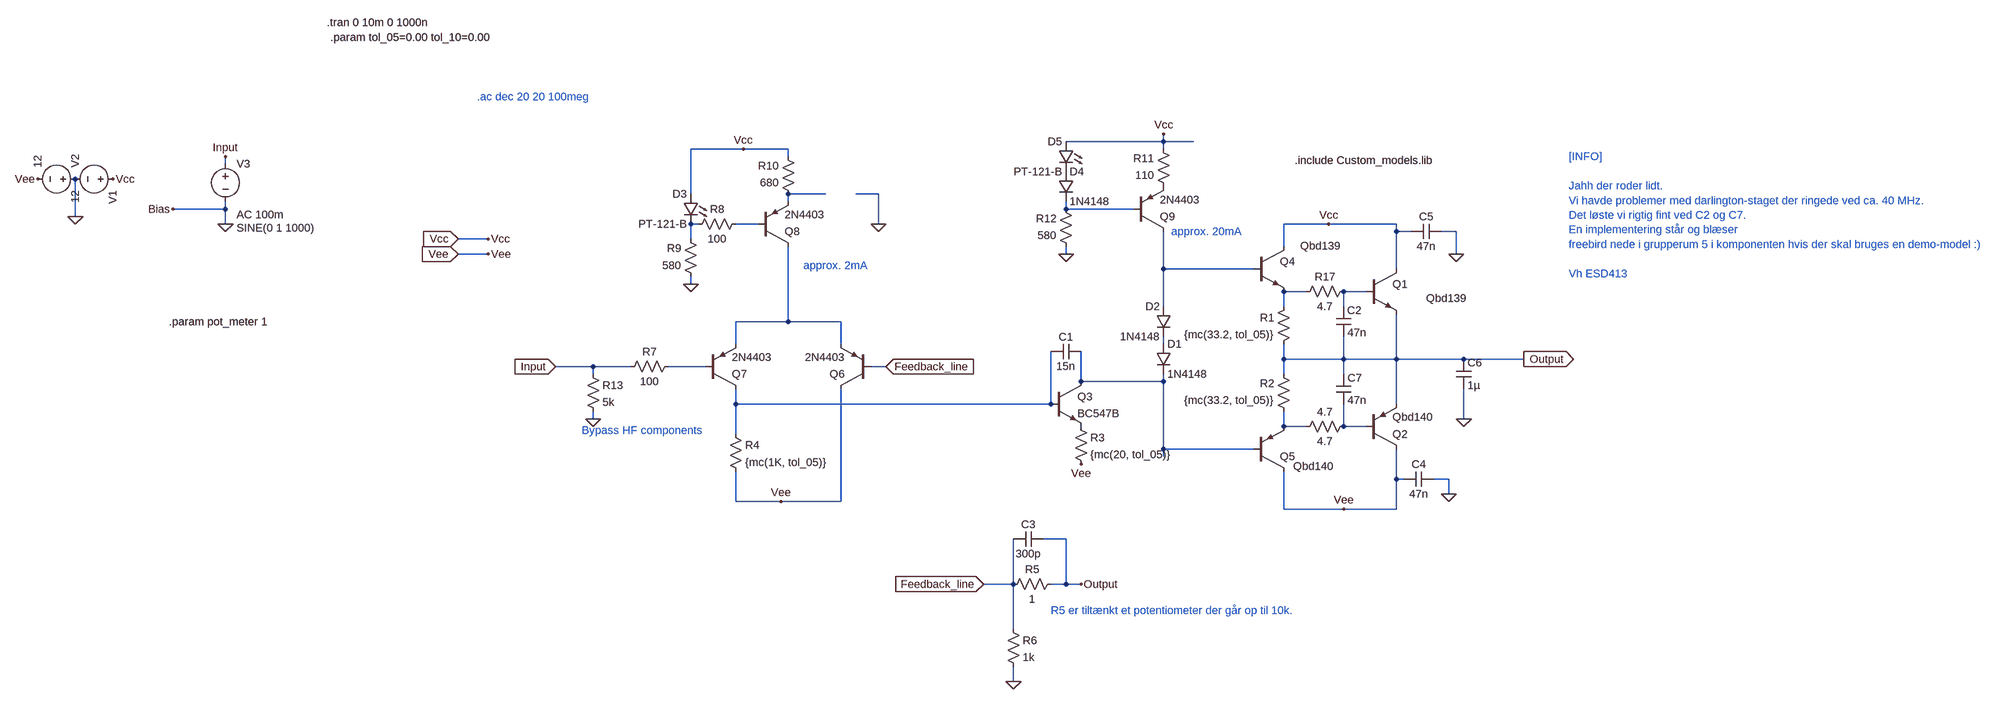
[diagram p0: schematic Smadrekassen_v1.asc]
Smadrekassen_v1.asc, the LTspice schematic file:
Version 4
SHEET 1 2560 996
WIRE 736 -176 736 -192
WIRE 736 -176 528 -176
WIRE 800 -176 736 -176
WIRE -160 -160 -272 -160
WIRE -64 -160 -160 -160
WIRE 736 -160 736 -176
WIRE -64 -144 -64 -160
WIRE -1264 -128 -1264 -144
WIRE -272 -64 -272 -160
WIRE 16 -64 -64 -64
WIRE 128 -64 80 -64
WIRE -64 -48 -64 -64
WIRE -1264 -32 -1264 -48
WIRE -1264 -32 -1376 -32
WIRE 528 -32 528 -48
WIRE 672 -32 528 -32
WIRE -1584 -16 -1584 -96
WIRE -1264 0 -1264 -32
WIRE -256 0 -272 0
WIRE -128 0 -176 0
WIRE 128 0 128 -64
WIRE 1088 0 992 0
WIRE 1232 0 1088 0
WIRE 1232 16 1232 0
WIRE 1264 16 1232 16
WIRE 1360 16 1328 16
WIRE -704 32 -768 32
WIRE -272 32 -272 0
WIRE 992 48 992 0
WIRE -704 64 -768 64
WIRE 528 64 528 48
WIRE 1360 64 1360 16
WIRE 736 96 736 16
WIRE 928 96 736 96
WIRE 1232 96 1232 16
WIRE -272 128 -272 112
WIRE 1040 144 992 144
WIRE 1168 144 1120 144
WIRE 736 176 736 96
WIRE 992 176 992 144
WIRE 1120 176 1120 144
WIRE -64 208 -64 48
WIRE -64 208 -176 208
WIRE 48 208 -64 208
WIRE -176 256 -176 208
WIRE 48 256 48 208
WIRE 736 256 736 240
WIRE 992 288 992 256
WIRE 1120 288 1120 240
WIRE 1120 288 992 288
WIRE 1232 288 1232 192
WIRE 1232 288 1120 288
WIRE 1376 288 1232 288
WIRE 1504 288 1376 288
WIRE -480 304 -560 304
WIRE -400 304 -480 304
WIRE -240 304 -320 304
WIRE 144 304 112 304
WIRE -480 320 -480 304
WIRE 992 320 992 288
WIRE 1120 320 1120 288
WIRE 560 336 560 272
WIRE 736 336 736 320
WIRE 736 336 560 336
WIRE -176 384 -176 352
WIRE 496 384 496 272
WIRE 496 384 -176 384
WIRE 1232 384 1232 288
WIRE -480 416 -480 400
WIRE 1376 416 1376 352
WIRE 992 432 992 400
WIRE 1040 432 992 432
WIRE 1120 432 1120 384
WIRE 1168 432 1120 432
WIRE -176 448 -176 384
WIRE 736 480 736 336
WIRE 928 480 736 480
WIRE 736 496 736 480
WIRE 1232 544 1232 480
WIRE 1248 544 1232 544
WIRE 1344 544 1312 544
WIRE 1344 576 1344 544
WIRE -176 592 -176 528
WIRE -80 592 -176 592
WIRE 48 592 48 352
WIRE 48 592 -80 592
WIRE 992 608 992 528
WIRE 1120 608 992 608
WIRE 1232 608 1232 544
WIRE 1232 608 1120 608
WIRE 528 672 480 672
WIRE 416 768 416 672
WIRE 416 768 352 768
WIRE 528 768 528 672
WIRE 528 768 496 768
WIRE 560 768 528 768
WIRE 416 864 416 768
WIRE 416 976 416 944
FLAG 1088 0 Vcc
FLAG 736 -192 Vcc
FLAG 560 512 Vee
FLAG 1504 288 Output
IOPIN 1504 288 Out
FLAG -160 -160 Vcc
FLAG 560 768 Output
FLAG 416 976 0
FLAG -560 304 Input
IOPIN -560 304 In
FLAG -80 592 Vee
FLAG 1120 608 Vee
FLAG -272 128 0
FLAG 528 64 0
FLAG -768 32 Vcc
IOPIN -768 32 In
FLAG -768 64 Vee
IOPIN -768 64 In
FLAG -704 32 Vcc
FLAG -704 64 Vee
FLAG 352 768 Feedback_line
IOPIN 352 768 In
FLAG -1584 -16 0
FLAG -1664 -96 Vee
FLAG -1264 0 0
FLAG -1264 -144 Input
FLAG -1504 -96 Vcc
FLAG -1376 -32 Bias
FLAG 144 304 Feedback_line
IOPIN 144 304 In
FLAG 128 0 0
FLAG 1344 576 0
FLAG 1360 64 0
FLAG -480 416 0
FLAG 1376 416 0
SYMBOL npn 496 336 R0
SYMATTR InstName Q3
SYMATTR Value BC547B
SYMBOL npn 928 48 R0
WINDOW 3 99 -1 Left 2
SYMATTR InstName Q4
SYMATTR Value Qbd139
SYMBOL pnp 928 528 M180
WINDOW 3 84 11 Left 2
SYMATTR InstName Q5
SYMATTR Value Qbd140
SYMBOL res 1008 160 M0
SYMATTR InstName R1
SYMATTR Value {mc(33.2, tol_05)}
SYMATTR SpiceLine tol=1 pwr=0.1
SYMBOL res 1008 416 R180
WINDOW 0 36 76 Left 2
WINDOW 3 36 40 Left 2
SYMATTR InstName R2
SYMATTR Value {mc(33.2, tol_05)}
SYMATTR SpiceLine tol=1 pwr=0.1
SYMBOL diode 720 256 R0
SYMATTR InstName D1
SYMATTR Value 1N4148
SYMBOL res 544 416 R0
SYMATTR InstName R3
SYMATTR Value {mc(20, tol_05)}
SYMATTR SpiceLine tol=1 pwr=0.1
SYMBOL pnp 112 352 R180
SYMATTR InstName Q6
SYMATTR Value 2N4403
SYMBOL pnp -240 352 M180
SYMATTR InstName Q7
SYMATTR Value 2N4403
SYMBOL res -192 432 R0
SYMATTR InstName R4
SYMATTR Value {mc(1K, tol_05)}
SYMATTR SpiceLine tol=1 pwr=0.1
SYMBOL diode 752 176 M0
SYMATTR InstName D2
SYMATTR Value 1N4148
SYMBOL LED -256 -64 M0
SYMATTR InstName D3
SYMATTR Value PT-121-B
SYMBOL pnp -128 48 M180
SYMATTR InstName Q8
SYMATTR Value 2N4403
SYMBOL res -160 -16 R90
WINDOW 0 0 56 VBottom 2
WINDOW 3 32 56 VTop 2
SYMATTR InstName R8
SYMATTR Value 100
SYMBOL res -256 128 R180
WINDOW 0 36 76 Left 2
WINDOW 3 36 40 Left 2
SYMATTR InstName R9
SYMATTR Value 580
SYMBOL res -48 -48 R180
WINDOW 0 36 76 Left 2
WINDOW 3 36 40 Left 2
SYMATTR InstName R10
SYMATTR Value 680
SYMBOL pnp 672 16 M180
SYMATTR InstName Q9
SYMATTR Value 2N4403
SYMBOL res 752 -64 R180
WINDOW 0 36 76 Left 2
WINDOW 3 36 40 Left 2
SYMATTR InstName R11
SYMATTR Value 110
SYMBOL res 544 64 R180
WINDOW 0 36 76 Left 2
WINDOW 3 36 40 Left 2
SYMATTR InstName R12
SYMATTR Value 580
SYMBOL diode 512 -112 R0
SYMATTR InstName D4
SYMATTR Value 1N4148
SYMBOL LED 544 -176 M0
SYMATTR InstName D5
SYMATTR Value PT-121-B
SYMBOL voltage -1488 -96 R90
WINDOW 123 0 0 Left 0
WINDOW 39 0 0 Left 0
SYMATTR InstName V1
SYMATTR Value 12
SYMBOL voltage -1568 -96 M270
WINDOW 123 0 0 Left 0
WINDOW 39 0 0 Left 0
SYMATTR InstName V2
SYMATTR Value 12
SYMBOL voltage -1264 -144 R0
WINDOW 123 24 124 Left 2
WINDOW 39 0 0 Left 0
WINDOW 3 24 152 Left 2
SYMATTR Value2 AC 100m
SYMATTR Value SINE(0 1 1000)
SYMATTR InstName V3
SYMBOL res -304 288 R90
WINDOW 0 0 56 VBottom 2
WINDOW 3 32 56 VTop 2
SYMATTR InstName R7
SYMATTR Value 100
SYMBOL res 400 848 R0
SYMATTR InstName R6
SYMATTR Value 1k
SYMBOL res 512 752 R90
WINDOW 0 0 56 VBottom 2
WINDOW 3 32 56 VTop 2
SYMATTR InstName R5
SYMATTR Value 1
SYMBOL cap 560 256 R90
WINDOW 0 0 32 VBottom 2
WINDOW 3 32 32 VTop 2
SYMATTR InstName C1
SYMATTR Value 15n
SYMBOL cap 480 656 R90
WINDOW 0 0 32 VBottom 2
WINDOW 3 32 32 VTop 2
SYMATTR InstName C3
SYMATTR Value 300p
SYMBOL npn 1168 96 R0
WINDOW 3 128 62 Left 2
SYMATTR Value Qbd139
SYMATTR InstName Q1
SYMBOL pnp 1168 480 M180
SYMATTR InstName Q2
SYMATTR Value Qbd140
SYMBOL cap 1312 528 R90
WINDOW 0 0 32 VBottom 2
WINDOW 3 32 32 VTop 2
SYMATTR InstName C4
SYMATTR Value 47n
SYMBOL cap 1328 0 R90
WINDOW 0 0 32 VBottom 2
WINDOW 3 32 32 VTop 2
SYMATTR InstName C5
SYMATTR Value 47n
SYMBOL res -496 304 R0
SYMATTR InstName R13
SYMATTR Value 5k
SYMBOL cap 1360 288 R0
SYMATTR InstName C6
SYMATTR Value 1µ
SYMBOL res 1136 416 R90
WINDOW 0 0 56 VBottom 2
WINDOW 3 32 56 VTop 2
SYMATTR InstName 4.7
SYMATTR Value 4.7
SYMBOL res 1136 128 R90
WINDOW 0 0 56 VBottom 2
WINDOW 3 32 56 VTop 2
SYMATTR InstName R17
SYMATTR Value 4.7
SYMBOL cap 1104 176 R0
WINDOW 0 23 8 Left 2
SYMATTR InstName C2
SYMATTR Value 47n
SYMBOL cap 1104 320 R0
SYMATTR InstName C7
SYMATTR Value 47n
TEXT -32 88 Left 2 ;approx. 2mA
TEXT 752 16 Left 2 ;approx. 20mA
TEXT 1016 -136 Left 2 !.include Custom_models.lib
TEXT -1048 -472 Left 2 !.tran 0 10m 0 1000n
TEXT -1040 -440 Left 2 !.param tol_05=0.00 tol_10=0.00
TEXT -728 -272 Left 2 ;.ac dec 20 20 100meg
TEXT -1384 208 Left 2 !.param pot_meter 1
TEXT -504 440 Left 2 ;Bypass HF components
TEXT 1600 -144 Left 2 ;[INFO]\n \nJahh der roder lidt.\nVi havde problemer med darlington-staget der ringede ved ca. 40 MHz.\nDet løste vi rigtig fint ved C2 og C7.\nEn implementering står og blæser \nfreebird nede i grupperum 5 i komponenten hvis der skal bruges en demo-model :)\n \nVh ESD413
TEXT 496 824 Left 2 ;R5 er tiltænkt et potentiometer der går op til 10k.

The netlist it stands for:
* Smadrekassen_v1.asc
Q3 N011 N012 P001 0 BC547B
Q4 Vcc N005 N006 0 Qbd139
Q5 Vee N011 N013 0 Qbd140
R1 N006 Output {mc(33.2, tol_05)} tol=1 pwr=0.1
R2 N013 Output {mc(33.2, tol_05)} tol=1 pwr=0.1
D1 N009 N011 1N4148
R3 P001 Vee {mc(20, tol_05)} tol=1 pwr=0.1
Q6 Vee Feedback_line N008 0 2N4403
Q7 N012 N010 N008 0 2N4403
R4 N012 Vee {mc(1K, tol_05)} tol=1 pwr=0.1
D2 N005 N009 1N4148
D3 Vcc N003 PT-121-B
Q8 N008 N004 N001 0 2N4403
R8 N004 N003 100
R9 0 N003 580
R10 N001 Vcc 680
Q9 N005 N002 P002 0 2N4403
R11 P002 Vcc 110
R12 0 N002 580
D4 P003 N002 1N4148
D5 Vcc P003 PT-121-B
V1 Vcc 0 12
V2 0 Vee 12
V3 Input 0 SINE(0 1 1000) AC 100m
R7 N010 Input 100
R6 Feedback_line 0 1k
R5 Output Feedback_line 1
C1 N011 N012 15n
C3 Output Feedback_line 300p
Q1 Vcc N007 Output 0 Qbd139
Q2 Vee N014 Output 0 Qbd140
C4 0 Vee 47n
C5 0 Vcc 47n
R13 Input 0 5k
C6 Output 0 1µ
R§4.7 N014 N013 4.7
R17 N007 N006 4.7
C2 N007 Output 47n
C7 Output N014 47n
.model D D
.lib standard.dio
.model NPN NPN
.model PNP PNP
.lib standard.bjt
* approx. 2mA
* approx. 20mA
.include Custom_models.lib
.tran 0 10m 0 1000n
.param tol_05=0.00 tol_10=0.00
* .ac dec 20 20 100meg
.param pot_meter 1
* Bypass HF components
* [INFO]
* Jahh der roder lidt.
* Vi havde problemer med darlington-staget der ringede ved ca. 40 MHz.
* Det løste vi rigtig fint ved C2 og C7.
* En implementering står og blæser
* freebird nede i grupperum 5 i komponenten hvis der skal bruges en demo-model :)
* Vh ESD413
* R5 er tiltænkt et potentiometer der går op til 10k.
.backanno
.end